# EAGLE design WidefieldController (EAGLE 9.6.2)
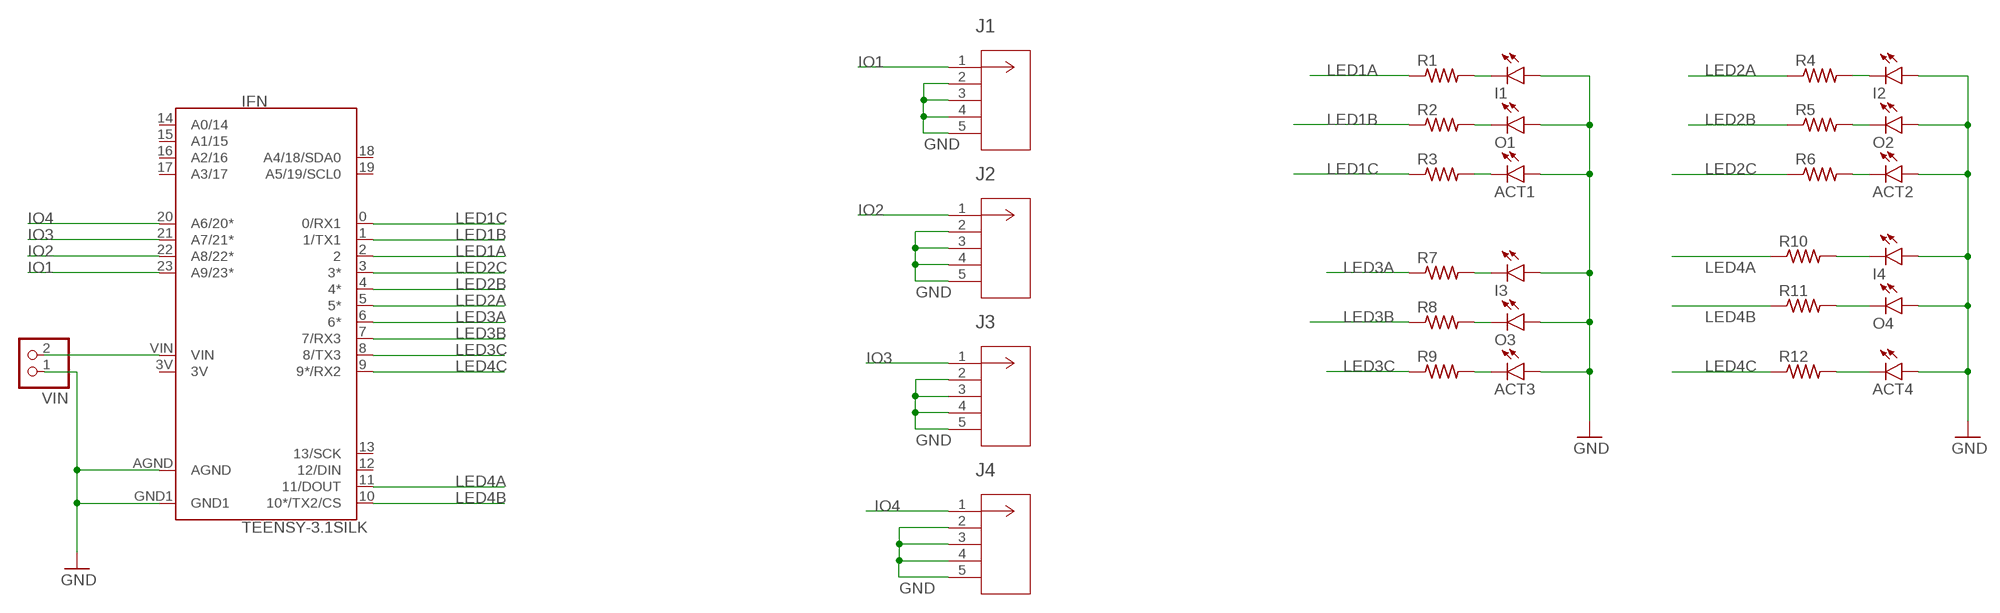
[diagram p0: schematic, sheet 1]

## Parts
ACT1  LEDCHIPLED_0603  [CHIPLED_0603]
ACT2  LEDCHIPLED_0603  [CHIPLED_0603]
ACT3  LEDCHIPLED_0603  [CHIPLED_0603]
ACT4  LEDCHIPLED_0603  [CHIPLED_0603]
I1  LEDCHIPLED_0603  [CHIPLED_0603]
I2  LEDCHIPLED_0603  [CHIPLED_0603]
I3  LEDCHIPLED_0603  [CHIPLED_0603]
I4  LEDCHIPLED_0603  [CHIPLED_0603]
IFN  TEENSY-3.1SILK  [TEENSY-3.1]
J1  5-1634503-1  [CONN5_5-1634503-1_TEC]
J2  5-1634503-1  [CONN5_5-1634503-1_TEC]
J3  5-1634503-1  [CONN5_5-1634503-1_TEC]
J4  5-1634503-1  [CONN5_5-1634503-1_TEC]
O1  LEDCHIPLED_0603  [CHIPLED_0603]
O2  LEDCHIPLED_0603  [CHIPLED_0603]
O3  LEDCHIPLED_0603  [CHIPLED_0603]
O4  LEDCHIPLED_0603  [CHIPLED_0603]
R1  R-US_R0603  [R0603]
R2  R-US_R0603  [R0603]
R3  R-US_R0603  [R0603]
R4  R-US_R0603  [R0603]
R5  R-US_R0603  [R0603]
R6  R-US_R0603  [R0603]
R7  R-US_R0603  [R0603]
R8  R-US_R0603  [R0603]
R9  R-US_R0603  [R0603]
R10  R-US_R0603  [R0603]
R11  R-US_R0603  [R0603]
R12  R-US_R0603  [R0603]
VIN  PINHD-1X2  [1X02]

## Nets
GND: ACT1.A ACT2.A ACT3.A ACT4.A I1.A I2.A I3.A I4.A IFN.AGND IFN.GND1 J1.2 J1.3 J1.4 J1.5 J2.2 J2.3 J2.4 J2.5 J3.2 J3.3 J3.4 J3.5 J4.2 J4.3 J4.4 J4.5 O1.A O2.A O3.A O4.A VIN.1
IO1: IFN.23(A9/23*) J1.1
IO2: IFN.22(A8/22*) J2.1
IO3: IFN.21(A7/21*) J3.1
IO4: IFN.20(A6/20*) J4.1
LED1A: IFN.2 R1.1
LED1B: IFN.1(1/TX1) R2.1
LED1C: IFN.0(0/RX1) R3.1
LED2A: IFN.5(5*) R4.1
LED2B: IFN.4(4*) R5.1
LED2C: IFN.3(3*) R6.1
LED3A: IFN.6(6*) R7.1
LED3B: IFN.7(7/RX3) R8.1
LED3C: IFN.8(8/TX3) R9.1
LED4A: IFN.11(11/DOUT) R10.1
LED4B: IFN.10(10*/TX2/CS) R11.1
LED4C: IFN.9(9*/RX2) R12.1
N$1: I2.C R4.2
N$2: O2.C R5.2
N$3: ACT2.C R6.2
N$4: I4.C R10.2
N$5: O4.C R11.2
N$6: ACT4.C R12.2
N$7: IFN.VIN VIN.2
N$8: ACT3.C R9.2
N$9: O3.C R8.2
N$10: I3.C R7.2
N$11: I1.C R1.2
N$12: O1.C R2.2
N$13: ACT1.C R3.2
Unconnected: IFN.12(12/DIN) IFN.13(13/SCK) IFN.14(A0/14) IFN.15(A1/15) IFN.16(A2/16) IFN.17(A3/17) IFN.18(A4/18/SDA0) IFN.19(A5/19/SCL0)

## Power pins joined to a net without a drawn wire
3V: IFN.3V

## Library data of the parts
ACT1-ACT4 I1-I4 O1-O4 = led:LED: LED OSRAM: - CHIPLED LG R971, LG N971, LY N971, LG Q971, LY Q971, LO R971, LY R971 LH N974, LH R974 LS Q976, LO Q976, LY Q976 LO Q996 - Hyper CHIPLED LW Q18S LB Q993, LB Q99A, LB R99A - SideLED LS A670, LO A670, LY A670, LG A670, LP A670 LB A673, LV A673, LT A673, LW A673 LH A674 LY A675 LS A676, LA A676, LO A676, LY A676, LW A676 LS A679, LY A679, LG A679 - Hyper Micro SIDELED® LS Y876, LA Y876, LO Y876, LY Y876 LT Y87S - SmartLED LW L88C, LW L88S LB L89C, LB L89S, LG L890 LS L89K, LO L89K, LY L89K LS L896, LA L896, LO L896, LY L896 - TOPLED LS T670, LO T670, LY T670, LG T670, LP T670 LSG T670, LSP T670, LSY T670, LOP T670, LYG T670 LG T671, LOG T671, LSG T671 LB T673, LV T673, LT T673, LW T673 LH T674 LS T676, LA T676, LO T676, LY T676, LB T676, LH T676, LSB T676, LW T676 LB T67C, LV T67C, LT T67C, LS T67K, LO T67K, LY T67K, LW E67C LS E67B, LA E67B, LO E67B, LY E67B, LB E67C, LV E67C, LT E67C LW T67C LS T679, LY T679, LG T679 LS T770, LO T770, LY T770, LG T770, LP T770 LB T773, LV T773, LT T773, LW T773 LH T774 LS E675, LA E675, LY E675, LS T675 LS T776, LA T776, LO T776, LY T776, LB T776 LHGB T686 LT T68C, LB T68C - Hyper Mini TOPLED® LB M676 - Mini TOPLED Santana® LG M470 LS M47K, LO M47K, LY M47K Source: http://www.osram.convergy.de LUXEON: - LUMILED® LXK2-PW12-R00, LXK2-PW12-S00, LXK2-PW14-U00, LXK2-PW14-V00 LXK2-PM12-R00, LXK2-PM12-S00, LXK2-PM14-U00 LXK2-PE12-Q00, LXK2-PE12-R00, LXK2-PE12-S00, LXK2-PE14-T00, LXK2-PE14-U00 LXK2-PB12-K00, LXK2-PB12-L00, LXK2-PB12-M00, LXK2-PB14-N00, LXK2-PB14-P00, LXK2-PB14-Q00 LXK2-PR12-L00, LXK2-PR12-M00, LXK2-PR14-Q00, LXK2-PR14-R00 LXK2-PD12-Q00, LXK2-PD12-R00, LXK2-PD12-S00 LXK2-PH12-R00, LXK2-PH12-S00 LXK2-PL12-P00, LXK2-PL12-Q00, LXK2-PL12-R00 Source: www.luxeon.com KINGBRIGHT: KA-3528ASYC Source: www.kingbright.com
IFN = SparkFun-Boards-TeensyMod:TEENSY-3.1: Teensy 3+ Footprint Mechanical footprint with connectors for Teensy Development Board with ARM Cortex. SparkFun Products: Teensy 3.2 <https://www.sparkfun.com/products/13736> Teensy LC <https://www.sparkfun.com/products/13305>; SF_ID: DEV-12646
J1-J4 = UsefulConnectors:5-1634503-1; BUILT_BY: EMA_UL_Team; COPYRIGHT: Copyright (C) 2016 Accelerated Designs. All rights reserved; DESCRIPTION: BNC Str PCB Skt 50Ohm Nickel Pltd; MANUFACTURER_PART_NUMBER: 5-1634503-1; PITCH_MM_: -; POSITIONS: 1; PRODUCT: -; ROWS-CONFIG: -; SOURCELIBRARY: TE_Connectivity-2018-03-16; TE_PART_NUMBER: 5-1634503-1; TYPE: Jack; VENDOR: TE Connectivity
R1-R12 = resistor:R-US_: RESISTOR, American symbol
VIN = pinhead:PINHD-1X2: PIN HEADER

## Board
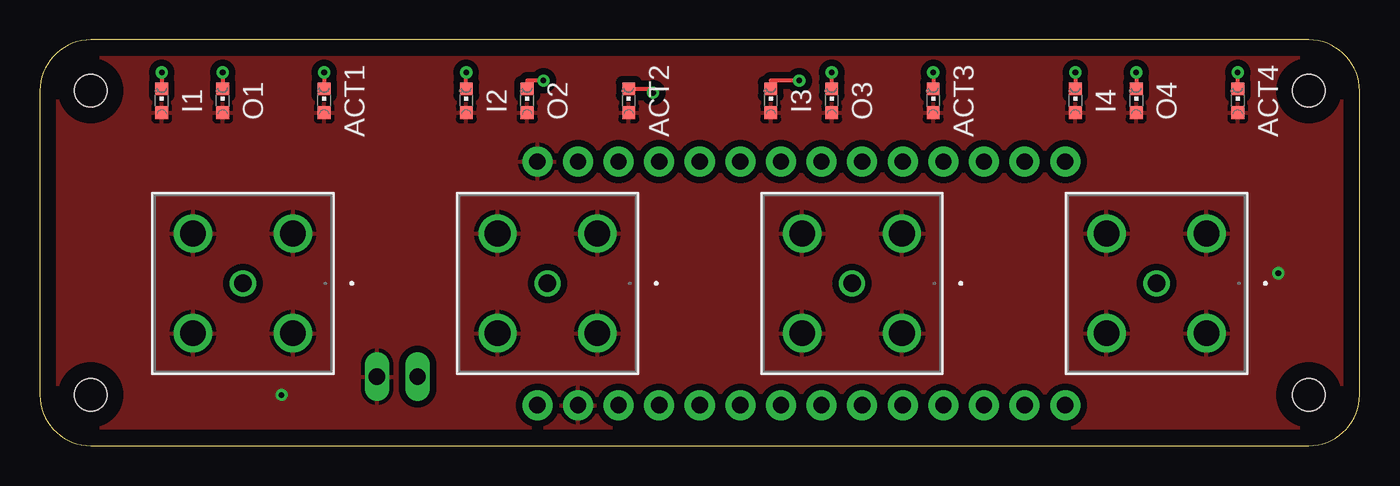
[diagram p1: board, top side]
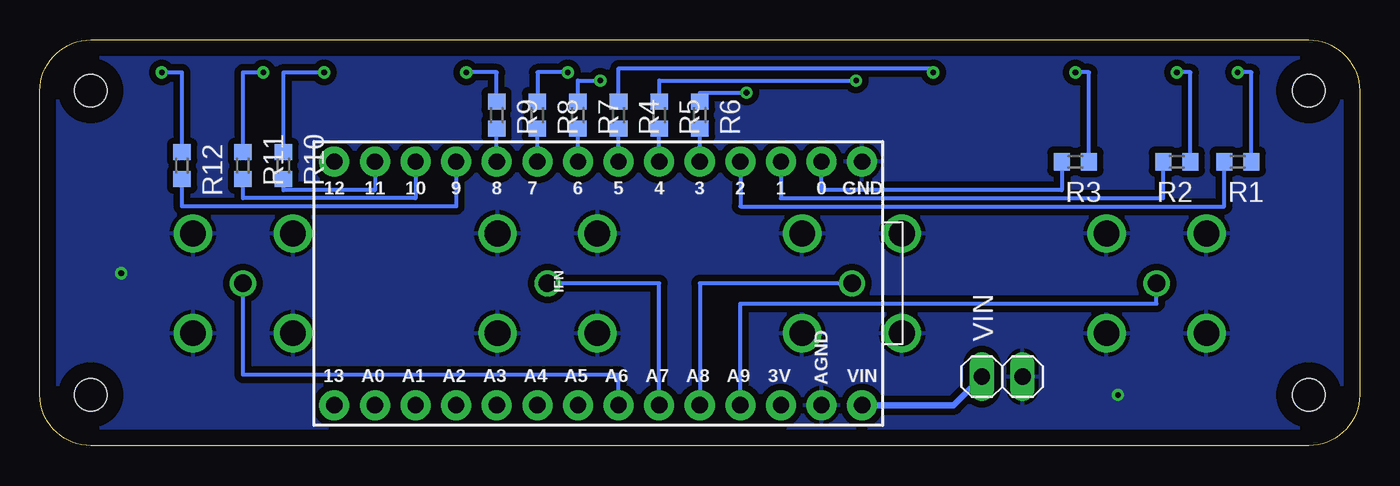
[diagram p2: board, bottom side, seen from below]

Size 82.55 x 25.4 mm. Coordinates in mm from the lower left corner, seen from the top.
Outline: 79.38,25.4 3.17,25.4 arc90 0,22.23 0,3.17 arc90 3.17,0 79.38,0 arc90 82.55,3.17 82.55,22.23 arc90 79.38,25.4
Copper layers (1*16): Top 0.035mm / dielectric 0.15mm / Bottom 0.035mm
Design rules "default": minimum track width 6mil, minimum drill 0.35mm, track to track 6mil, track to pad 6mil, pad to pad 6mil, via to via 6mil, smd to smd 6mil, copper to edge 40mil, drill to drill 6mil, minimum pad ring 10mil, minimum via ring 8mil, stop-mask expansion 4mil, vias tented up to drill 0mil, thermal gap 10mil
Holes 2.03 mm at 3.17,22.23 3.17,3.17 79.38,22.23 79.38,3.17

### Footprints (pad centres in the part's own frame; a part is rotated, then mirrored left to right if it is on the bottom)
CHIPLED_0603 = smd 0.8 x 0.8: A 0,-0.75; C 0,0.75
TEENSY-3.1 = drill 1.016 pad 1.88: 0 7.62,-13.97; 1 7.62,-11.43; 2 7.62,-8.89; 3 7.62,-6.35; 3V -7.62,-11.43; 4 7.62,-3.81; 5 7.62,-1.27; 6 7.62,1.27; 7 7.62,3.81; 8 7.62,6.35; 9 7.62,8.89; 10 7.62,11.43; 11 7.62,13.97; 12 7.62,16.51; 13 -7.62,16.51; 14 -7.62,13.97; 15 -7.62,11.43; 16 -7.62,8.89; 17 -7.62,6.35; 18 -7.62,3.81; 19 -7.62,1.27; 20 -7.62,-1.27; 21 -7.62,-3.81; 22 -7.62,-6.35; 23 -7.62,-8.89; AGND -7.62,-13.97; GND1 7.62,-16.51; VIN -7.62,-16.51
CONN5_5-1634503-1_TEC = drill 1.092 pad 1.6: 1 0,0 | drill 1.6 pad 2.108: 2 -3.124,3.124; 3 -3.124,-3.124; 4 3.124,-3.124; 5 3.124,3.124
R0603 = smd 1 x 1.1: 1 -0.85,0; 2 0.85,0
1X02 = drill 1.016 long: 1 -1.27,0; 2 1.27,0

### Placement (x,y rotation side)
ACT1  17.78,21.59 0 top
ACT2  36.83,21.59 0 top
ACT3  55.88,21.59 0 top
ACT4  74.93,21.59 0 top
I1  7.62,21.59 0 top
I2  26.67,21.59 0 top
I3  45.72,21.59 0 top
I4  64.77,21.59 0 top
IFN  47.62,10.16 90 bottom
J1  12.7,10.16 0 top
J2  31.75,10.16 0 top
J3  50.8,10.16 0 top
J4  69.85,10.16 0 top
O1  11.43,21.59 0 top
O2  30.48,21.59 0 top
O3  49.53,21.59 0 top
O4  68.58,21.59 0 top
R1  7.62,17.78 0 bottom
R2  11.43,17.78 0 bottom
R3  17.78,17.78 0 bottom
R4  46.35,20.7 90 bottom
R5  43.81,20.7 90 bottom
R6  41.27,20.7 90 bottom
R7  48.9,20.7 90 bottom
R8  51.44,20.7 90 bottom
R9  53.98,20.7 90 bottom
R10  67.31,17.53 90 bottom
R11  69.85,17.53 90 bottom
R12  73.66,17.53 90 bottom
VIN  22.35,4.32 180 bottom

### Tracks (layer width: path | path; a pad name or v marks a point on that pad's centre or on a via)
GND  (via drill 0.35)
  other vias: 15.11,3.17 77.47,10.79
  pour Bottom (isolate 0.406): 0,0 82.55,0 82.55,25.4 0,25.4
  pour Top (isolate 0.406): 0,0 82.55,0 82.55,25.4 0,25.4
IO1
  Bottom 0.254: IFN.23 38.73,8.89 12.7,8.89 J1.1
IO2
  Bottom 0.254: J2.1 41.27,10.16 IFN.22
IO3
  Bottom 0.254: IFN.21 43.81,10.16 J3.1
IO4
  Bottom 0.254: IFN.20 46.35,4.45 69.85,4.45 J4.1
LED1A
  Bottom 0.254: IFN.2 38.73,14.99 8.47,14.99 R1.1
LED1B
  Bottom 0.254: IFN.1 36.2,15.49 12.28,15.49 R2.1
LED1C
  Bottom 0.254: IFN.0 33.66,16 18.63,16 R3.1
LED2A
  Bottom 0.254: IFN.5 R4.1
LED2B
  Bottom 0.254: IFN.4 R5.1
LED2C
  Bottom 0.254: IFN.3 R6.1
LED3A
  Bottom 0.254: IFN.6 R7.1
LED3B
  Bottom 0.254: IFN.7 R8.1
LED3C
  Bottom 0.254: IFN.8 R9.1
LED4A
  Bottom 0.254: IFN.11 61.59,16 67.31,16 R10.1
LED4B
  Bottom 0.254: IFN.10 59.05,15.49 69.85,15.49 R11.1
LED4C
  Bottom 0.254: IFN.9 56.52,14.99 73.66,14.99 R12.1
N$1  (via drill 0.35)
  Top 0.254: I2.C v26.67,23.37
  Bottom 0.254: R4.2 46.35,23.62 26.67,23.62 v26.67,23.37
N$2  (via drill 0.35)
  Top 0.254: v31.5,22.86 30.48,22.86 O2.C
  Bottom 0.254: v31.5,22.86 43.81,22.86 R5.2
N$3  (via drill 0.35)
  Top 0.254: ACT2.C 38.35,22.34 v38.35,22.1
  Bottom 0.254: R6.2 41.27,22.1 v38.35,22.1
N$4  (via drill 0.35)
  Top 0.254: v64.77,23.37 I4.C
  Bottom 0.254: R10.2 67.31,23.37 v64.77,23.37
N$5  (via drill 0.35)
  Top 0.254: v68.58,23.37 O4.C
  Bottom 0.254: R11.2 69.85,23.37 v68.58,23.37
N$6  (via drill 0.35)
  Top 0.254: ACT4.C v74.93,23.37
  Bottom 0.254: R12.2 73.66,23.37 v74.93,23.37
N$7
  Bottom 0.406: IFN.VIN 25.4,2.54 VIN.2
N$8  (via drill 0.35)
  Top 0.254: v55.88,23.37 ACT3.C
  Bottom 0.254: v55.88,23.37 53.98,23.37 R9.2
N$9  (via drill 0.35)
  Top 0.254: O3.C v49.53,23.37
  Bottom 0.254: v49.53,23.37 51.44,23.37 R8.2
N$10  (via drill 0.35)
  Top 0.254: v47.5,22.86 45.72,22.86 I3.C
  Bottom 0.254: R7.2 48.9,22.86 v47.5,22.86
N$11  (via drill 0.35)
  Top 0.254: v7.62,23.37 I1.C
  Bottom 0.254: R1.2 6.77,23.37 v7.62,23.37
N$12  (via drill 0.35)
  Top 0.254: v11.43,23.37 O1.C
  Bottom 0.254: R2.2 10.58,23.37 v11.43,23.37
N$13  (via drill 0.35)
  Top 0.254: v17.78,23.37 ACT1.C
  Bottom 0.254: R3.2 16.93,23.37 v17.78,23.37